# Altium schematic sheet [7]-GSM_MODEM_MAIN.SchDoc
size A4
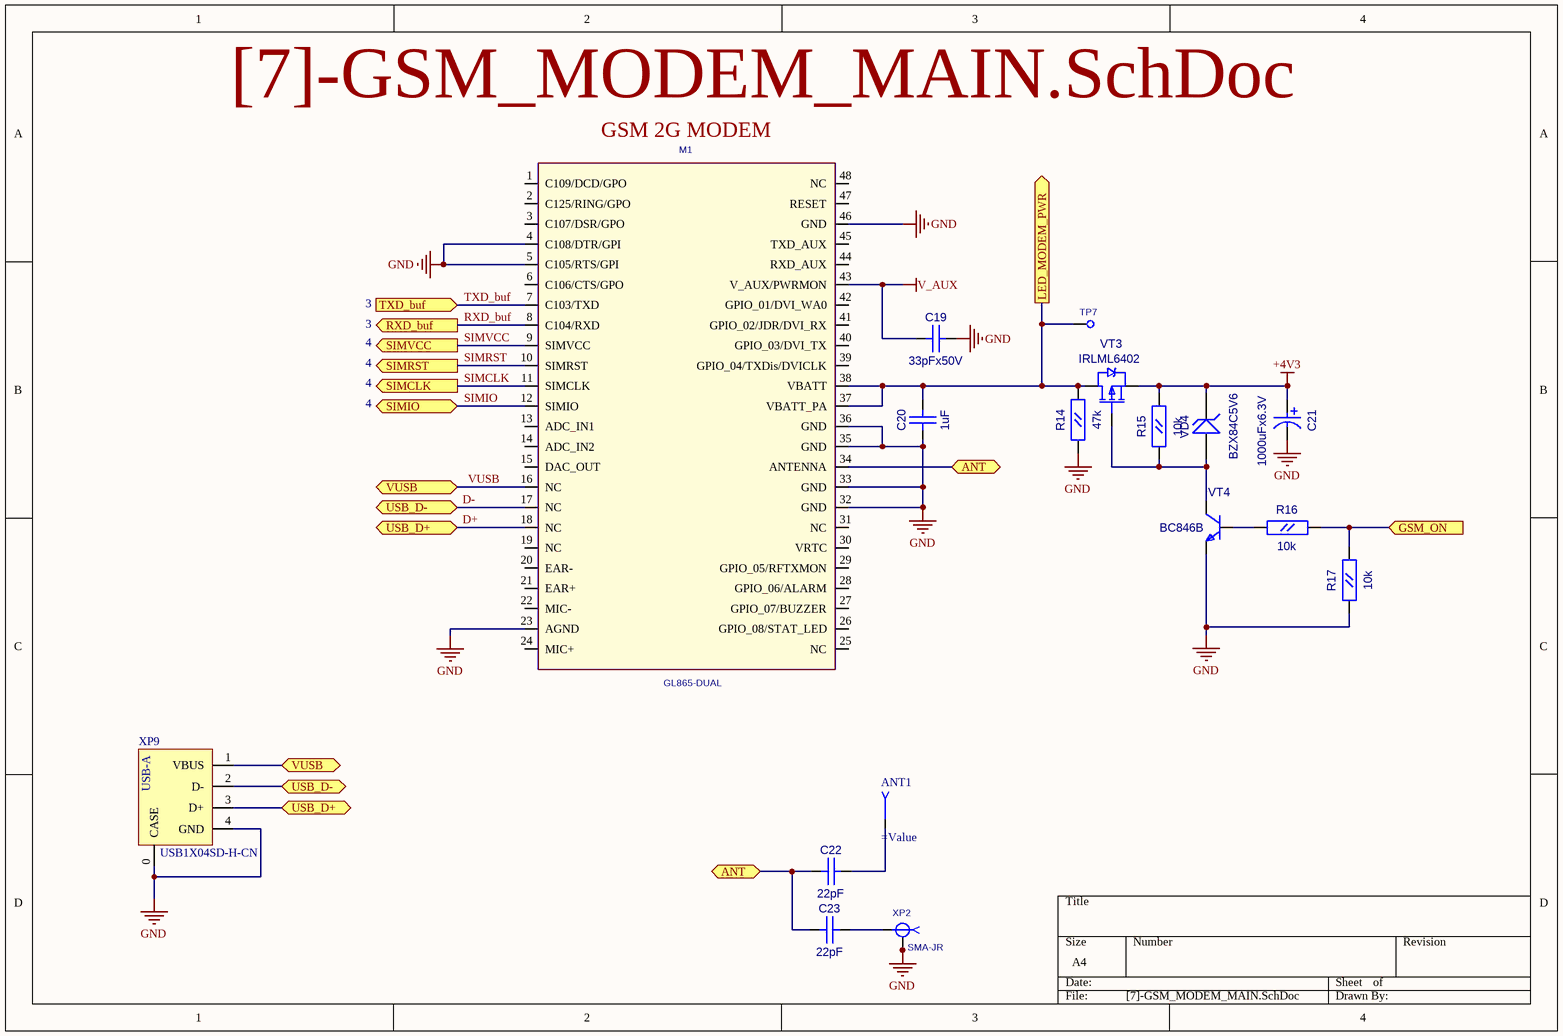
[diagram p0: [7]-GSM_MODEM_MAIN.SchDoc]

## Parts
ANT1  (no value)  [GSM_ANTENNA_MEANDER]
C19  33pFx50V  [CC0603]
C20  1uF  [CC0603]
C21  value 1000uFx6.3V  [CC8X3.5]  (hidden comment: CAP0.35)
C22  22pF  [CC0603]
C23  22pF  [CC0603]
M1  GL865-DUAL  [GL868-DUAL]
R14  47k  [RC0603]
R15  10k  [RC0603]
R16  10k  [RC0603]
R17  10k  [RC0603]
TP7  TESTPOINT1  [TESTPOINT1]  (value not drawn)
VD4  BZX84C5V6  [SOT-23(123)]
VT3  IRLML6402  [SOT-23(123)]
VT4  BC846B  [SOT-23(123)]
XP2  SMA-JR  [SMA-JR]
XP9  USB1X04SD-H-CN  [USB_A_FRONT]

## Ports
ANT (bidir), GSM_ON (in), LED_MODEM_PWR (out), RXD_buf (out), SIMCLK (out), SIMIO (bidir), SIMRST (out), SIMVCC (out), TXD_buf (in), USB_D+ (bidir), USB_D- (bidir), VUSB (bidir)

## Nets
+4V3: C21.1 R15.2(B) VD4.3(K) VT3.2(S)
GND: C19.2(B) C20.1(A) C21.2 M1.4(C108/DTR/GPI) M1.5(C105/RTS/GPI) M1.23(AGND) M1.32(GND) M1.33(GND) M1.35(GND) M1.36(GND) M1.46(GND) R14.1(A) R17.1(A) VT4.2(E) XP2.2 XP2.3 XP2.4 XP2.5 XP9.0(CASE) XP9.4(GND)
V_AUX: C19.1(A) M1.43(V_AUX/PWRMON)
ANT: C22.1(A) C23.1(A) M1.34(ANTENNA) ; port ANT
D+: M1.18(NC) XP9.3(D+) ; port USB_D+
D-: M1.17(NC) XP9.2(D-) ; port USB_D-
GSM_ON: R16.2(B) R17.2(B) ; port GSM_ON
LED_MODEM_PWR: C20.2(B) M1.37(VBATT_PA) M1.38(VBATT) R14.2(B) TP7.1 VT3.3(D) ; port LED_MODEM_PWR
RXD_buf: M1.8(C104/RXD) ; port RXD_buf
SIMCLK: M1.11(SIMCLK) ; port SIMCLK
SIMIO: M1.12(SIMIO) ; port SIMIO
SIMRST: M1.10(SIMRST) ; port SIMRST
SIMVCC: M1.9(SIMVCC) ; port SIMVCC
TXD_buf: M1.7(C103/TXD) ; port TXD_buf
VUSB: M1.16(NC) XP9.1(VBUS) ; port VUSB
NetANT1_1: ANT1.1 C22.2(B)
NetC23_2: C23.2(B) XP2.1
NetR15_1: R15.1(A) VD4.1(A) VT3.1(G) VT4.3(C)
NetR16_1: R16.1(A) VT4.1(B)

Not connected (* = marked no-connect by the designer): M1 1(C109/DCD/GPO) 2(C125/RING/GPO) 3(C107/DSR/GPO) 6(C106/CTS/GPO) 13(ADC_IN1) 14(ADC_IN2) 15(DAC_OUT) 19(NC) 20(EAR-) 21(EAR+) 22(MIC-) 24(MIC+) 25(NC) 26(GPIO_08/STAT_LED) 27(GPIO_07/BUZZER) 28(GPIO_06/ALARM) 29(GPIO_05/RFTXMON) 30(VRTC) 31(NC) 39(GPIO_04/TXDis/DVICLK) 40(GPIO_03/DVI_TX) 41(GPIO_02/JDR/DVI_RX) 42(GPIO_01/DVI_WA0) 44(RXD_AUX) 45(TXD_AUX) 47(RESET) 48(NC)

## Notes on the sheet
- (near M1) GSM 2G MODEM
- 3
- 4
- (in symbol USB_A_VERTICAL) USB-A

## Library data of the parts
ANT1 = GSM_ANTENNA_MEANDR: 900-1800 Meandered GSM antenna 1.6mm FR4
C19 C20 C22 C23 = CC0603
  C19: Value: 33pFx50V
  C20: Value: 1uF
  C22 C23: Value: 22pF
M1 = GL868-DUAL: Value: *
R14-R17 = RC0603
  R14: Value: 47k
  R15-R17: Value: 10k
VD4 = BZX84: Zener Voltage Regulator Diode; Value: BZX84C5V6
VT3 = IRLML6402: HEXFET Power MOSFET; OriginalName: IRLML5103; ComponentField7: Published 8-Jun-2000; Value: IRLML6402
VT4 = BC846BLT1: ComponentField7: Published 29-Sep-2000; OriginalName: BC846BLT1; Value: BC846B
XP9 = USB_A_VERTICAL: Vertical USB connetctor,type A.THR; Value: USB1X04SD-H-CN
TP7 = TESTPOINT1: Value: *
XP2 = SMA-JR: Value: *